# Altium schematic sheet US_SB_GC.SchDoc
size A4
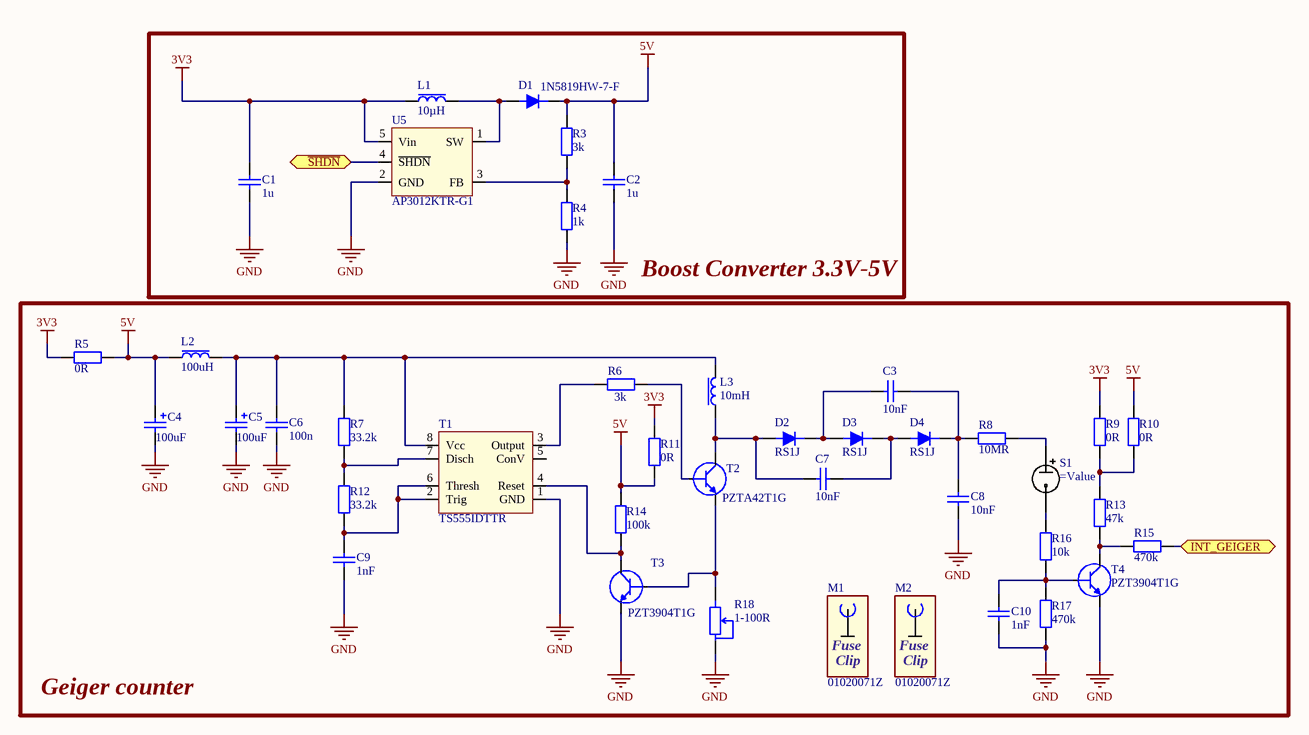
[diagram p0: US_SB_GC.SchDoc]

## Parts
C1  1u  [C0603_IPC_HD]
C2  1u  [C0603_IPC_HD]
C3  10nF  [Chip2Pin1206_10n]
C4  100uF  [CAPAE7866X77_100uF16V]
C5  100uF  [CAPAE7866X77_100uF16V]
C6  100n  [C0603_IPC_HD]
C7  10nF  [Chip2Pin1206_10n]
C8  10nF  [Chip2Pin1206_10n]
C9  1nF  [C0603_IPC_MD]
C10  1nF  [C0603_IPC_MD]
D1  1N5819HW-7-F  [1N5819HW_SODFL370X135-2N]
D2  RS1J  [RS1J-DFN]
D3  RS1J  [RS1J-DFN]
D4  RS1J  [RS1J-DFN]
L1  10µH  [NRH3012T100MN]
L2  100uH  [IND100uH_4040X18N]
L3  10mH  [IND10mH_12.7X12.7]
M1  01020071Z  (mechanical)
M2  01020071Z  (mechanical)
R3  3k  [C0603_IPC_HD]
R4  1k  [R0603_IPC_MD]
R5  0R  [R0603_IPC_MD]
R6  3k  [C0603_IPC_HD]
R7  33.2k  [R0603_IPC_MD]
R8  10MR  [C1206_IPC_MD]
R9  0R  [R0603_IPC_MD]
R10  0R  [R0603_IPC_MD]  (no BOM)
R11  0R  [R0603_IPC_MD]
R12  33.2k  [R0603_IPC_MD]
R13  47k  [R0603_IPC_HD]
R14  100k  [R0603_IPC_MD]
R15  470k  [C0603_IPC_HD]
R16  10k  [C1206_IPC_HD]
R17  470k  [C0603_IPC_HD]
R18  1-100R  [3296W_POT]
S1  (no value)  [SI-3BG]
T1  TS555IDTTR  [SOIC127P600X175-(TS555)]
T2  PZTA42T1G  [PZTA42T1G_SOT230P]
T3  PZT3904T1G  [PZT3904_SOT223]
T4  PZT3904T1G  [PZT3904_SOT223]
U5  AP3012KTR-G1  [AP3012_SOT95P280X145-5N]

## Blocks framed on the sheet
Boost Converter 3.3V-5V: C1 C2 D1 L1 R3 R4 U5
Geiger counter: C3-C10 D2-D4 L2 L3 M1 M2 R5-R18 S1 T1-T4

## Ports
INT_GEIGER, ~{SHDN}

## Nets
3V3: C1.2 L1.1 R5.1 R9.2 R11.2 U5.5(Vin)
5V: C2.2 C4.1 D1.2 L2.1 R3.2 R5.2 R10.2 R11.1 R14.2
GND: C1.1 C2.1 C4.2 C5.2 C6.2 C8.1 C9.1 C10.1 R4.1 R17.1 R18.2 T1.1(GND) T3.3(E) T4.3(E) U5.2(GND)
~{SHDN}: U5.4(~{SHDN}) ; port ~{SHDN}
INT_GEIGER: R15.2 ; port INT_GEIGER
NetC3_1: C3.1 D2.2 D3.1
NetC3_2: C3.2 C8.2 D4.2 R8.1
NetC5_1: C5.1 C6.1 L2.2 L3.2 R7.2 T1.8(Vcc)
NetC7_1: C7.1 D2.1 L3.1 T2.2(C)
NetC7_2: C7.2 D3.2 D4.1
NetC9_2: C9.2 R12.1 T1.2(Trig) T1.6(Thresh)
NetC10_2: C10.2 R16.1 R17.2 T4.1(B)
NetD1_1: D1.1 L1.2 U5.1(SW)
NetR3_1: R3.1 R4.2 U5.3(FB)
NetR6_1: R6.1 T1.3(Output)
NetR6_2: R6.2 T2.1(B)
NetR7_1: R7.1 R12.2 T1.7(Disch)
NetR8_2: R8.2 S1.1
NetR9_1: R9.1 R10.1 R13.2
NetR13_1: R13.1 R15.1 T4.2(C)
NetR14_1: R14.1 T1.4(Reset) T3.2(C)
NetR16_2: R16.2 S1.2
NetR18_1: R18.1 T2.3(E) T3.1(B)

Not connected (* = marked no-connect by the designer): T1 5(ConV)

## Notes on the sheet
- (in symbol FUSE_CLIP) Fuse; Clip

## Library data of the parts
C1 C2 = CL10B105MO8NNWC: CAP CER 1UF 16V X7R 0603; Manufacturer: Samsung Electro-Mechanics; Manufacturer Part Number: CL10B105MO8NNWC; Voltage: 16V; Value: 1u; Dielectric: X7R; Supplier 1: Digi-Key; Supplier Part Number 1: 1276-6524-1-ND
C3 C7 C8 = CL1206_10nF_1000V: CAP CER 10000PF 1000V X7R 1206; Manufacturer: Wurth Electronics Inc.; Manufacturer Part Number: 885342208021; Voltage: 1000V; Value: 10nF; Dielectric: X7R; Supplier 1: Digi-Key; Supplier Part Number 1: 732-12078-1-ND
C4 C5 = CP100uF_16V: CAP ALUM 100UF 20% 16V SMD; Manufacturer: Panasonic Electronic Components; Manufacturer Part Number: EEE-HC1C101XP; Dielectric: X7R; Voltage: 16V; Value: 100uF; Supplier 1: Digi-Key; Supplier Part Number 1: PCE3750CT-ND
C6 = CL10B104KO8NNNC: CAP CER 0.1UF 16V X7R 0603; Manufacturer: Samsung Electro-Mechanics; Manufacturer Part Number: CL10B104KO8NNNC; Voltage: 16V; Value: 100n; Dielectric: X7R; Supplier 1: Digi-Key; Supplier Part Number 1: 1276-1005-1-ND
C9 C10 = CL0603_1nF_0603: CAP CER 1000PF 50V X7R 0603; Manufacturer: Samsung Electro-Mechanics; Manufacturer Part Number: CL10B102KB8NNNC; Voltage: 50V; Value: 1nF; Dielectric: X7R; Supplier 1: Digi-Key; Supplier Part Number 1: 1276-1018-1-ND
D1 = 1N5819HW: DIODE SCHOTTKY 40V 1A SOD123; Manufacturer: Diodes Incorporated; Manufacturer Part Number: 1N5819HW-7-F; Voltage - DC Reverse (Vr) (Max): 40V; Supplier 1: Digi-Key; Supplier Part Number 1: 1N5819HW-FDICT-ND; Current - Average Rectified (Io): 1A
D2-D4 = RS1A-M: DIODE GEN PURP 600V 1A SMA; Manufacturer: ON Semiconductor; Reverse Recovery Time (trr): 250ns; Manufacturer Part Number: RS1J; Voltage - DC Reverse (Vr) (Max): 600V; Supplier 1: Digi-Key; Supplier Part Number 1: RS1JFSCT-ND; Current - Average Rectified (Io): 1A
L1 = 10uH_Inductor_720mA: 10µH Shielded Wirewound Inductor 720mA 324mOhm Max Nonstandard; Manufacturer: Taiyo Yuden; Manufacturer Part Number: NRH3012T100MN; Value: 10µH; Supplier 1: Digi-Key; Supplier Part Number 1: 587-2584-1-ND
L2 = 100UH.Inductor 280mA: 100µH Inductor 280mA 1.74 Ohm Max Nonstandard; Manufacturer: Taiyo Yuden; Manufacturer Part Number: NRS4018T101MDGJ; Value: 100uH; Supplier 1: Digi-Key; Supplier Part Number 1: 587-6091-1-ND
L3 = 10mH Inductor 180mA: 10mH Shielded Wirewound Inductor 180mA 19.2 Ohm Max Nonstandard; Manufacturer: Bourns Inc.; Manufacturer Part Number: SRR1208-103KL; Value: 10mH; Supplier 1: Digi-Key; Supplier Part Number 1: SRR1208-103KLCT-ND
M1 M2 = FUSE_CLIP: FUSE CLIP; Manufacturer: Littelfuse Inc.; Manufacturer Part Number: 01020071Z; Supplier 1: Digi-Key; Supplier Part Number 1: F3781-ND
R3 R6 = CR0603-JW-3k: RES SMD 3K OHM 5% 1/10W 0603; Manufacturer: Bourns Inc.; Manufacturer Part Number: CR0603-JW-302ELF; Value: 3k; Tolarance: ±5%; Supplier 1: Digi-Key; Supplier Part Number 1: CR0603-JW-302ELFCT-ND
R4 = CR0603-JW-102ELF: RES SMD 1K OHM 5% 1/10W 0603; Manufacturer: Bourns Inc.; Value: 1k; Tolarance: 5%; Manufacturer Part Number: CR0603-JW-102ELF; Supplier 1: Digi-Key; Supplier Part Number 1: CR0603-JW-102ELFCT-ND
R5 R9-R11 = CR0603-J/-000ELF: RES SMD 0 OHM JUMPER 1/10W 0603; Manufacturer: Bourns Inc.; Tolarance: 1%; Value: 0R; Manufacturer Part Number: CR0603-J/-000ELF; Supplier 1: Digi-Key; Supplier Part Number 1: CR0603-J/-000ELFCT-ND
R7 R12 = RMCF0603FT33K2: RES 33.2K OHM 1% 1/10W 0603; Manufacturer: Stackpole Electronics Inc; Value: 33.2k; Tolarance: 1%; Manufacturer Part Number: RMCF0603FT33K2; Supplier 1: Digi-Key; Supplier Part Number 1: RMCF0603FT33K2CT-ND
R8 = CR1206-JW-10MOm: RES SMD 10M OHM 5% 1/4W 1206; Manufacturer: Bourns Inc.; Manufacturer Part Number: CR1206-JW-106ELF; Value: 10MR; Tolarance: ±5%; Supplier 1: Digi-Key; Supplier Part Number 1: CR1206-JW-106ELFCT-ND
R13 = CR0603-JW-473ELF: RES SMD 47K OHM 5% 1/10W 0603; Manufacturer: Bourns Inc.; Value: 47k; Tolarance: 5%; Manufacturer Part Number: CR0603-JW-473ELF; Supplier 1: Digi-Key; Supplier Part Number 1: CR0603-JW-473ELFCT-ND
R14 = CR0603-JW-104ELF: RES 100K OHM 1% 1/10W 0603; Manufacturer: Stackpole Electronics Inc; Manufacturer Part Number: RMCF0603FT100K; Value: 100k; Tolarance: ±1%; Supplier 1: Digi-Key; Supplier Part Number 1: RMCF0603FT100KCT-ND
R15 R17 = CR0603-JW-470k: RES SMD 470K OHM 5% 1/10W 0603; Manufacturer: Bourns Inc.; Manufacturer Part Number: CR0603-JW-474ELF; Value: 470k; Tolarance: ±5%; Supplier 1: Digi-Key; Supplier Part Number 1: CR0603-JW-474ELFCT-ND
R16 = CR1206-JW-10k: RES SMD 10K OHM 5% 1/4W 1206; Manufacturer: Bourns Inc.; Manufacturer Part Number: CR1206-JW-103ELF; Value: 10k; Tolarance: ±5%; Supplier 1: Digi-Key; Supplier Part Number 1: CR1206-JW-103ELFCT-ND
R18 = 3296W-1-101R: 100 ±10% ±250ppm/℃ 3296W Precision Potentiometer RoH; Manufacturer: Chengdu Guosheng Tech; Value: 1-100R; Tolarance: 10%; Manufacturer Part Number: 3296W-1-101; Supplier 1: LCSC; Supplier Part Number 1: C118961
S1 = GEIGER TUBE: FUSE CLIP CARTRIDGE PCB (FOR GEIGER TUBE); Manufacturer: USSR; Manufacturer Part Number: SI-3BG; Supplier 1: Kharkiv; Supplier Part Number 1: SI-3BG
T1 = TS555: 555 Type, Timer/Oscillator (Single) IC 2.7MHz 8-SO; Manufacturer: STMicroelectronics; Manufacturer Part Number: TS555IDTTR; Supplier 1: Digi-Key; Supplier Part Number 1: 497-16404-1-ND
T2 = PZTA42T1(MPSA42 ): Bipolar (BJT) Transistor NPN 300V 500mA 50MHz 1.5W Surface Mount SOT-223; Manufacturer: ON Semiconductor; Current - Collector (Ic) (Max): 500mA; Voltage - Collector Emitter Breakdown (Max): 300V; Manufacturer Part Number: PZTA42T1G; Supplier 1: Digi-Key; Supplier Part Number 1: PZTA42T1GOSCT-ND
T3 T4 = PZT3904(2N3904): Bipolar (BJT) Transistor NPN 40V 200mA 300MHz 1.5W Surface Mount SOT-223; Manufacturer: ON Semiconductor; Current - Collector (Ic) (Max): 200mA; Voltage - Collector Emitter Breakdown (Max): 40V; Manufacturer Part Number: PZT3904T1G; Supplier 1: Digi-Key; Supplier Part Number 1: PZT3904T1GOSCT-ND
U5 = AP3012KTR: Boost Switching Regulator IC Positive Adjustable 1.25V 1 Output 500mA (Switch) SC-74A, SOT-753; Manufacturer: Diodes Incorporated; Manufacturer Part Number: AP3012KTR-G1; Supplier 1: Digi-Key; Supplier Part Number 1: AP3012KTR-G1DICT-ND